# Altium schematic sheet Peripherals.SchDoc
size A; SheetNumber: 5; SheetTotal: 5
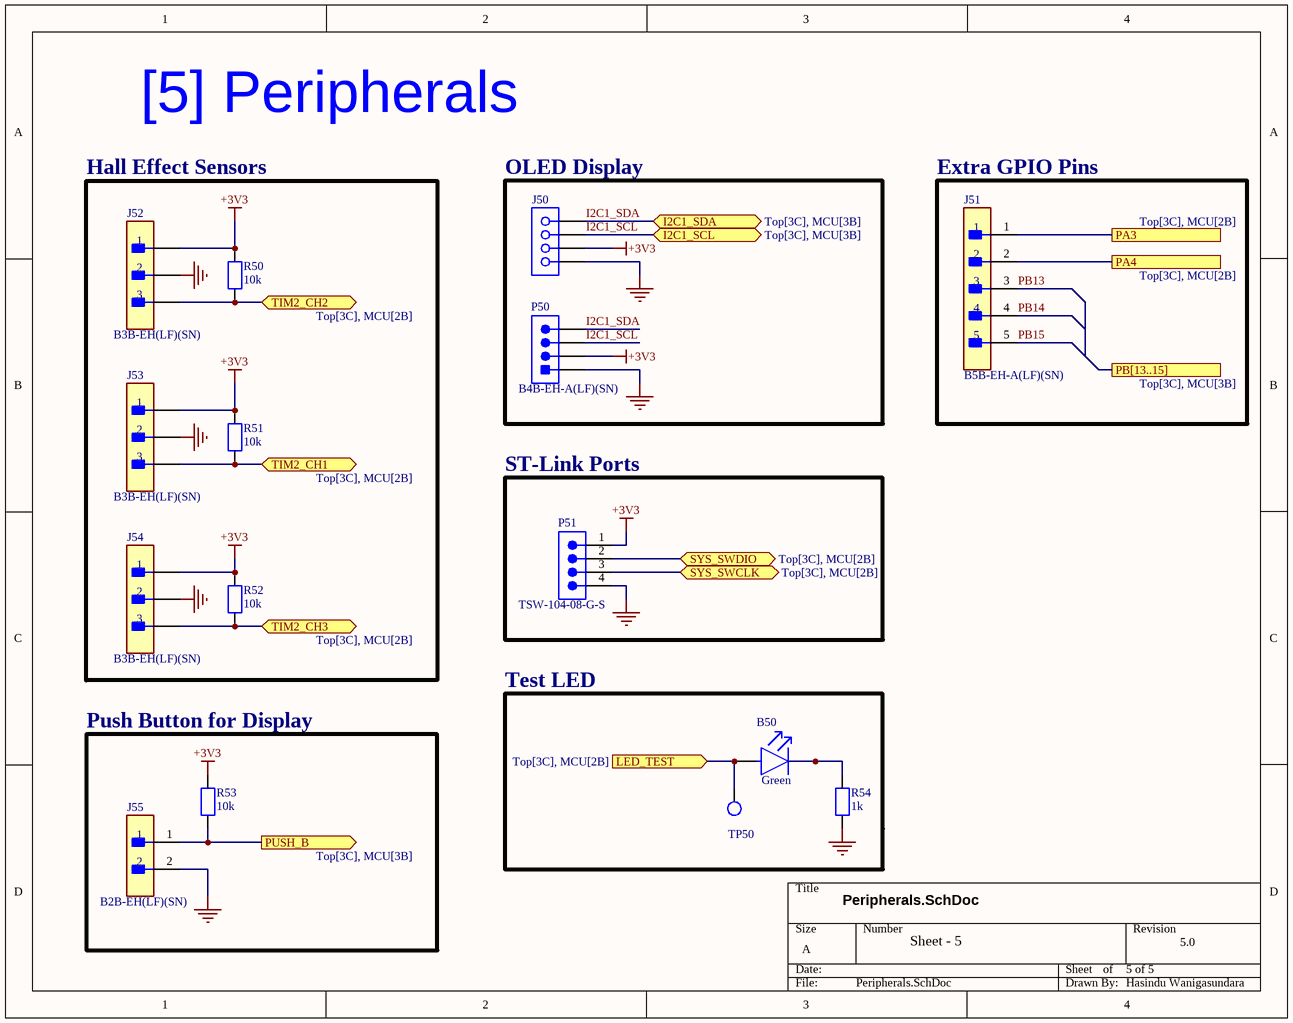
[diagram p0: Peripherals.SchDoc]

## Parts
B50  Green  [FP-LTST-C171GKT-MFG]
J50  61300411821  [61300411821]  (value not drawn)
J51  B5B-EH-A(LF)(SN)  [FP-B5B-EH-A_LF_SN-MFG]
J52  B3B-EH(LF)(SN)  [FP-B3B-EH_LF_SN-MFG]
J53  B3B-EH(LF)(SN)  [FP-B3B-EH_LF_SN-MFG]
J54  B3B-EH(LF)(SN)  [FP-B3B-EH_LF_SN-MFG]
J55  B2B-EH(LF)(SN)  [FP-B2B-EH_LF_SN-MFG]
P50  B4B-EH-A(LF)(SN)  [JST-B4B-EH-A_V]
P51  TSW-104-08-G-S  [SMTC-TSW-104-08-X-S]
R50  10k  [RES_1206]
R51  10k  [RES_1206]
R52  10k  [RES_1206]
R53  10k  [RES_1206]
R54  1k  [RES_1206]
TP50  Test Pad  [Test Pad]  (value not drawn)

## Blocks framed on the sheet
Hall Effect Sensors: J52-J54 R50-R52
OLED Display: J50 P50
Extra GPIO Pins: J51
ST-Link Ports: P51
Push Button for Display: J55 R53

## Ports
I2C1_SCL (bidir, see Top[3C], MCU[3B]), I2C1_SDA (bidir, see Top[3C], MCU[3B]), LED_TEST (in, see Top[3C], MCU[2B]), PA3 (see Top[3C], MCU[2B]), PA4 (see Top[3C], MCU[2B]), PB[13..15] (see Top[3C], MCU[3B]), PUSH_B (out, see Top[3C], MCU[3B]), SYS_SWCLK (bidir, see Top[3C], MCU[2B]), SYS_SWDIO (bidir, see Top[3C], MCU[2B]), TIM2_CH1 (bidir, see Top[3C], MCU[2B]), TIM2_CH2 (bidir, see Top[3C], MCU[2B]), TIM2_CH3 (bidir, see Top[3C], MCU[2B])

## Nets
+3V3: J50.2 J52.1 J53.1 J54.1 P50.2 P51.1 R50.2 R51.2 R52.2 R53.2
GND: J50.1 J52.2 J53.2 J54.2 J55.2 P50.1 P51.4 R54.1
I2C1_SCL: J50.3 P50.3 ; port I2C1_SCL
I2C1_SDA: J50.4 P50.4 ; port I2C1_SDA
LED_TEST: B50.2(A) TP50.1 ; port LED_TEST
PA3: J51.1 ; port PA3
PA4: J51.2 ; port PA4
PB13: J51.3
PB14: J51.4
PB15: J51.5
PUSH_B: J55.1 R53.1 ; port PUSH_B
SYS_SWCLK: P51.3 ; port SYS_SWCLK
SYS_SWDIO: P51.2 ; port SYS_SWDIO
TIM2_CH1: J53.3 R51.1 ; port TIM2_CH1
TIM2_CH2: J52.3 R50.1 ; port TIM2_CH2
TIM2_CH3: J54.3 R52.1 ; port TIM2_CH3
NetB50_1: B50.1(C) R54.2

## Notes on the sheet
- [5] Peripherals
- Test LED
- Peripherals.SchDoc
- Sheet - 5
- 5 of 5
- 5.0
- Hasindu Wanigasundara

## Library data of the parts
B50 = CMP-22017-000007-1: LED GREEN CLEAR CHIP SMD; Luminous Intensity: 12mcd; Lens Color: Colorless; Dominant Wavelength: 569nm; Number of LEDs: 1; Power Dissipation: 100mW; Viewing Angle: 130°; Reverse Voltage: 5V; Test Current: 10mA; Forward Voltage: 2.1V; Wavelength: 585nm; Lens Style: Diffused; Forward Current: 30mA; Height: 0.8mm; Mount: Surface Mount; Package Quantity: 1; Length: 2mm; Case Code (Metric): 2012; Number of Pins: 2; Number of Elements: 1; Packaging: Tape and Reel; Color: Green; Min Operating Temperature: -55°C; Case/Package: 0805; Power Rating: 100mW; Max Operating Temperature: 85°C; Radiation Hardening: No; Depth: 1.25mm; Lens Transparency: Clear; Width: 1.25mm; Lead Free: Lead Free; Case Code (Imperial): 0805; Illumination Color: Green
J50 = CMP-1502-01316-4: THT Vertical Socket Header WR-PHD, Pitch 2.54 mm, Single Row, 4 pins; Current Rating: 3A; Gender: Female; Contact Resistance: 20mΩ; Operating Supply Voltage: 250V; Number of Pins: 4; Lead Pitch: 2.54mm; Orientation: Vertical
J51 = CMP-17439-000382-1: CONN HEADER VERT 5POS 2.5MM; Number of Contacts: 5; Mated Stacking Heights: 8.1mm; Current Rating: 3A; Gender: Male; Voltage Rating: 250V; Lead Free: Lead Free; Fastening Type: Friction; Contact Type: Male Pin; Insulation Color: Natural; Insulation Material: Nylon; Contact Material: Brass; Contact Mating Length: 0.13inch; Pitch: 2.5mm; Number of Positions: 5; Number of Rows: 1; Connector Type: Header; Color: Natural; Contact Shape: Square; Flammability Rating: UL94 V-0; Orientation: Straight; Packaging: Bulk; Mount: Through Hole; Contact Finish - Mating: TIN; Contact Plating: Tin; Series: EH; Termination: Solder; Housing Color: White
J52-J54 = CMP-17439-000692-1: 3 Position Single Row 2.5 mm Press Fit Through Hole Shrouded Pin Header; Voltage Rating: 250V; Pitch: 2.5mm; Current Rating: 3A; Number of Positions: 3; Termination: Solder; Contact Material: Brass; Series: EH; Mount: Through Hole; Number of Contacts: 3; Number of Rows: 1; Lead Free: Lead Free; Orientation: Straight
J55 = CMP-17439-000683-1: Connector Header, EH Series, 2 Position, 2.5mm, Through Hole, Press-Fit, Solder, Natural; Voltage Rating: 250V; Current Rating: 3A; Number of Positions: 2; Lead Free: Lead Free; Series: EH; Orientation: Straight; Pitch: 2.5mm; Termination: Solder; Mount: Through Hole; Number of Rows: 1; Contact Material: Brass; Number of Contacts: 2
P50 = CMP-2000-05904-1: Male Header, Pitch 2.5 mm, 1 x 4 Position, Height 6 mm, Tail Length 3.2 mm, -25 to 85 degC, RoHS, Bulk; Manufacturer: JST; Style/Orientation: StraightHeader/Plug; Pitch: 2.5mm; No of Positions: 4; Mounting Technology: SurfaceMount; Package Description: Male Header, Pitch 2.5 mm, 1 x 4 Position, Height 6 mm, Tail Length 3.2 mm; Datasheet Version: 12/2012; Type: ShroudedHeader; Package Reference: B4B-EH-A; Manufacturer URL: http://www.jst.com/home2.html; Termination: Crimp; Datasheet URL: http://www.jst-mfg.com/product/pdf/eng/eEH.pdf
P51 = CMP-1024-00357-1: 0.025" SQ Post Header, Through-hole, Vertical, -55 to 125 degC, 2.54 mm Pitch, 4-Pin, Male, RoHS; Manufacturer: Samtec; Pitch: 2.54 mm; RoHS: True; ComponentLink3URL: http://www.samtec.com/documents/webfiles/cpdf/TSW-XXX-XX-XXX-X-XX-XXX-MKT.pdf; Mounting Technology: Through-hole; ComponentLink2URL: http://www.samtec.com/documents/webfiles/pdf/TSW_TH.PDF; ComponentLink1URL: http://www.samtec.com; ComponentLink3Description: Package Specification; PackageVersion: DM, 8/1988; ComponentLink2Description: Datasheet; PackageReference: TSW-104-08-X-S; PackageDescription: .025[0.64] SQ. Post Terminal Strip Assembly; PartNumber: TSW-104-08-G-S; ComponentLink1Description: Manufacturer URL; Temperature Range: -55 to 125 degC; DatasheetVersion: F-214; Orientation: Vertical
R50-R54 = RES_1206: SMD 3.2mm × 1.6mm size resistor (1206); Manufacturer: *; Manufacturer part number: *